# Altium schematic sheet MMC_Interface.SchDoc
size A3; Author: Marcelo Vicente; Organization: Univ. of Wisconsin-Madison; Address1: Madison, WI 53706; DocumentNumber: 2; SheetNumber: 2; SheetTotal: 5
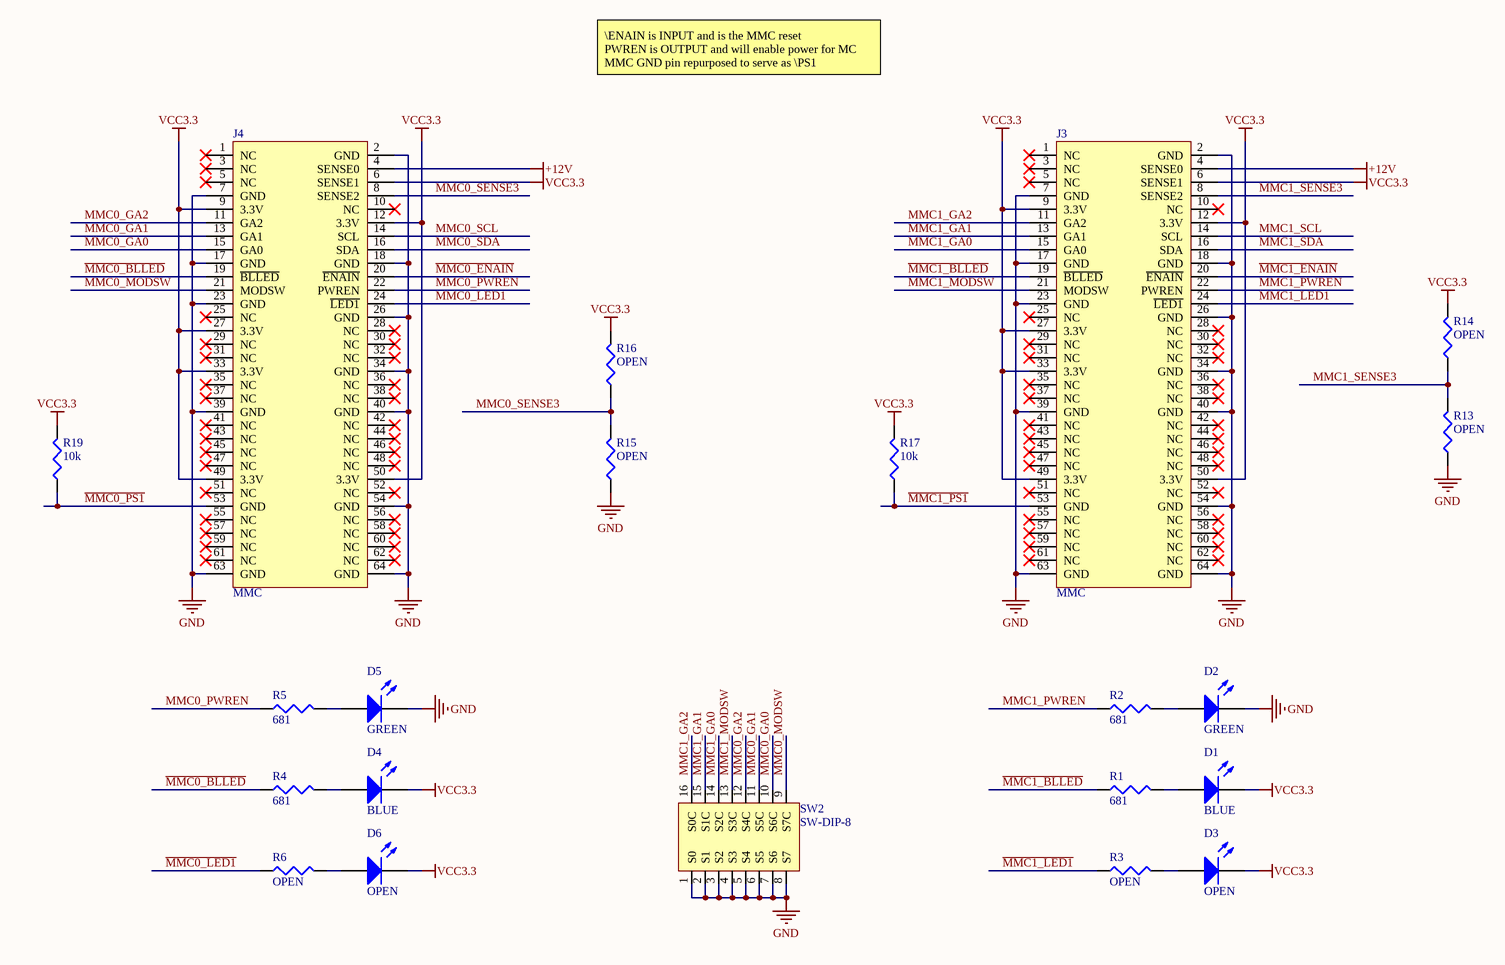
[diagram p0: MMC_Interface.SchDoc]

## Parts
D1  BLUE  [LED0603_M]
D2  GREEN  [LED0603_M]
D3  OPEN  [LED0603_M]
D4  BLUE  [LED0603_M]
D5  GREEN  [LED0603_M]
D6  OPEN  [LED0603_M]
J3  MMC  [5120527-1]
J4  MMC  [5120527-1]
R1  value 681  [R0603]  (hidden comment: ?)
R2  value 681  [R0603]  (hidden comment: ?)
R3  value OPEN  [R0402_IPC_H]  (hidden comment: ?)
R4  value 681  [R0603]  (hidden comment: ?)
R5  value 681  [R0603]  (hidden comment: ?)
R6  value OPEN  [R0402_IPC_H]  (hidden comment: ?)
R13  value OPEN  [R0402_IPC_H]  (hidden comment: ?)
R14  value OPEN  [R0402_IPC_H]  (hidden comment: ?)
R15  value OPEN  [R0402_IPC_H]  (hidden comment: ?)
R16  value OPEN  [R0402_IPC_H]  (hidden comment: ?)
R17  value 10k  [R0402_IPC_H]  (hidden comment: ?)
R19  value 10k  [R0402_IPC_H]  (hidden comment: ?)
SW2  SW-DIP-8  [TDA08H0]

## Nets
+12V: J3.4(SENSE0) J4.4(SENSE0)
GND: D2.2(K) D5.2(K) J3.2(GND) J3.7(GND) J3.17(GND) J3.18(GND) J3.23(GND) J3.26(GND) J3.34(GND) J3.39(GND) J3.40(GND) J3.54(GND) J3.63(GND) J3.64(GND) J4.2(GND) J4.7(GND) J4.17(GND) J4.18(GND) J4.23(GND) J4.26(GND) J4.34(GND) J4.39(GND) J4.40(GND) J4.54(GND) J4.63(GND) J4.64(GND) R13.1 R15.1 SW2.1(S0) SW2.2(S1) SW2.3(S2) SW2.4(S3) SW2.5(S4) SW2.6(S5) SW2.7(S6) SW2.8(S7)
VCC3.3: D1.2(K) D3.2(K) D4.2(K) D6.2(K) J3.6(SENSE1) J3.9(3.3V) J3.12(3.3V) J3.27(3.3V) J3.33(3.3V) J3.49(3.3V) J3.50(3.3V) J4.6(SENSE1) J4.9(3.3V) J4.12(3.3V) J4.27(3.3V) J4.33(3.3V) J4.49(3.3V) J4.50(3.3V) R14.2 R16.2 R17.2 R19.2
~{MMC0_BLLED}: J4.19(~{BLLED}) R4.1
~{MMC0_ENAIN}: J4.20(~{ENAIN})
~{MMC0_LED1}: J4.24(~{LED1}) R6.1
~{MMC0_PS1}: J4.53(GND) R19.1
~{MMC1_BLLED}: J3.19(~{BLLED}) R1.1
~{MMC1_ENAIN}: J3.20(~{ENAIN})
~{MMC1_LED1}: J3.24(~{LED1}) R3.1
~{MMC1_PS1}: J3.53(GND) R17.1
MMC0_GA0: J4.15(GA0) SW2.10(S6C)
MMC0_GA1: J4.13(GA1) SW2.11(S5C)
MMC0_GA2: J4.11(GA2) SW2.12(S4C)
MMC0_MODSW: J4.21(MODSW) SW2.9(S7C)
MMC0_PWREN: J4.22(PWREN) R5.1
MMC0_SCL: J4.14(SCL)
MMC0_SDA: J4.16(SDA)
MMC0_SENSE3: J4.8(SENSE2) R15.2 R16.1
MMC1_GA0: J3.15(GA0) SW2.14(S2C)
MMC1_GA1: J3.13(GA1) SW2.15(S1C)
MMC1_GA2: J3.11(GA2) SW2.16(S0C)
MMC1_MODSW: J3.21(MODSW) SW2.13(S3C)
MMC1_PWREN: J3.22(PWREN) R2.1
MMC1_SCL: J3.14(SCL)
MMC1_SDA: J3.16(SDA)
MMC1_SENSE3: J3.8(SENSE2) R13.2 R14.1
NetD1_1: D1.1(A) R1.2
NetD2_1: D2.1(A) R2.2
NetD3_1: D3.1(A) R3.2
NetD4_1: D4.1(A) R4.2
NetD5_1: D5.1(A) R5.2
NetD6_1: D6.1(A) R6.2

Not connected (* = marked no-connect by the designer): J3 1(NC)* 3(NC)* 5(NC)* 10(NC)* 25(NC)* 28(NC)* 29(NC)* 30(NC)* 31(NC)* 32(NC)* 35(NC)* 36(NC)* 37(NC)* 38(NC)* 41(NC)* 42(NC)* 43(NC)* 44(NC)* 45(NC)* 46(NC)* 47(NC)* 48(NC)* 51(NC)* 52(NC)* 55(NC)* 56(NC)* 57(NC)* 58(NC)* 59(NC)* 60(NC)* 61(NC)* 62(NC)*; J4 1(NC)* 3(NC)* 5(NC)* 10(NC)* 25(NC)* 28(NC)* 29(NC)* 30(NC)* 31(NC)* 32(NC)* 35(NC)* 36(NC)* 37(NC)* 38(NC)* 41(NC)* 42(NC)* 43(NC)* 44(NC)* 45(NC)* 46(NC)* 47(NC)* 48(NC)* 51(NC)* 52(NC)* 55(NC)* 56(NC)* 57(NC)* 58(NC)* 59(NC)* 60(NC)* 61(NC)* 62(NC)*

## Notes on the sheet
- \ENAIN is INPUT and is the MMC reset
  PWREN is OUTPUT and will enable power for MC
  MMC GND pin repurposed to serve as \PS1
- Description
- Title
- Size:
- Date:
- A3
- Number:
- Time:
- Revision:
- Sheet
- of
- File:
- Author:

## Library data of the parts
D1 D4 = LED: Light Emitting Diode; Mfg. Part No.: LTST-S270TBKT; INVKEY: LED-BL-RA-0603; Mfgr: Lite-On; Value: BLUE
D2 D5 = LED: Light Emitting Diode; Mfg. Part No.: LTST-S270KGKT; INVKEY: LED-GRN-RA-UB-0603; Mfgr: Lite-On; Value: GREEN
D3 D6 = LED: Light Emitting Diode; Mfg. Part No.: NA; Note: Do not assemble; Value: OPEN; INVKEY: ?; Mfgr: NA
J3 J4 = MMC: TE 5120527-1; INVKEY: CO-PMC64-120527-1; Mfgr: TE Connectivity; Mfg. Part No.: 5120527-1
R1 R2 R4 R5 = Res: Resistor; Mfg. Part No.: RC0603FR-07681RL; Tolerance: 1%; INVKEY: RS0603-681R-1/10W-1%; Mfgr: Yageo
R3 R6 R13-R16 = Res: Resistor; Mfg. Part No.: NA; Tolerance: 1%; INVKEY: RS0402-OPEN-1/10W; Note: Do not assemble; Mfgr: NA
R17 R19 = Res: Resistor; Mfg. Part No.: ERJ-2GEJ103X; Tolerance: 5%; INVKEY: RS0402-10K-1/10W-5%; Mfgr: Panasonic-ECG
SW2 = SW-DIP-8: C&K TDA08H0SB1R; Mfg. Part No.: TDA08HOSB1; INVKEY: SW-DIP-8X-SMD; Mfgr: C&K